# Altium schematic sheet Audio-HDMI.SchDoc
size A3; SheetNumber: 3; SheetTotal: 10
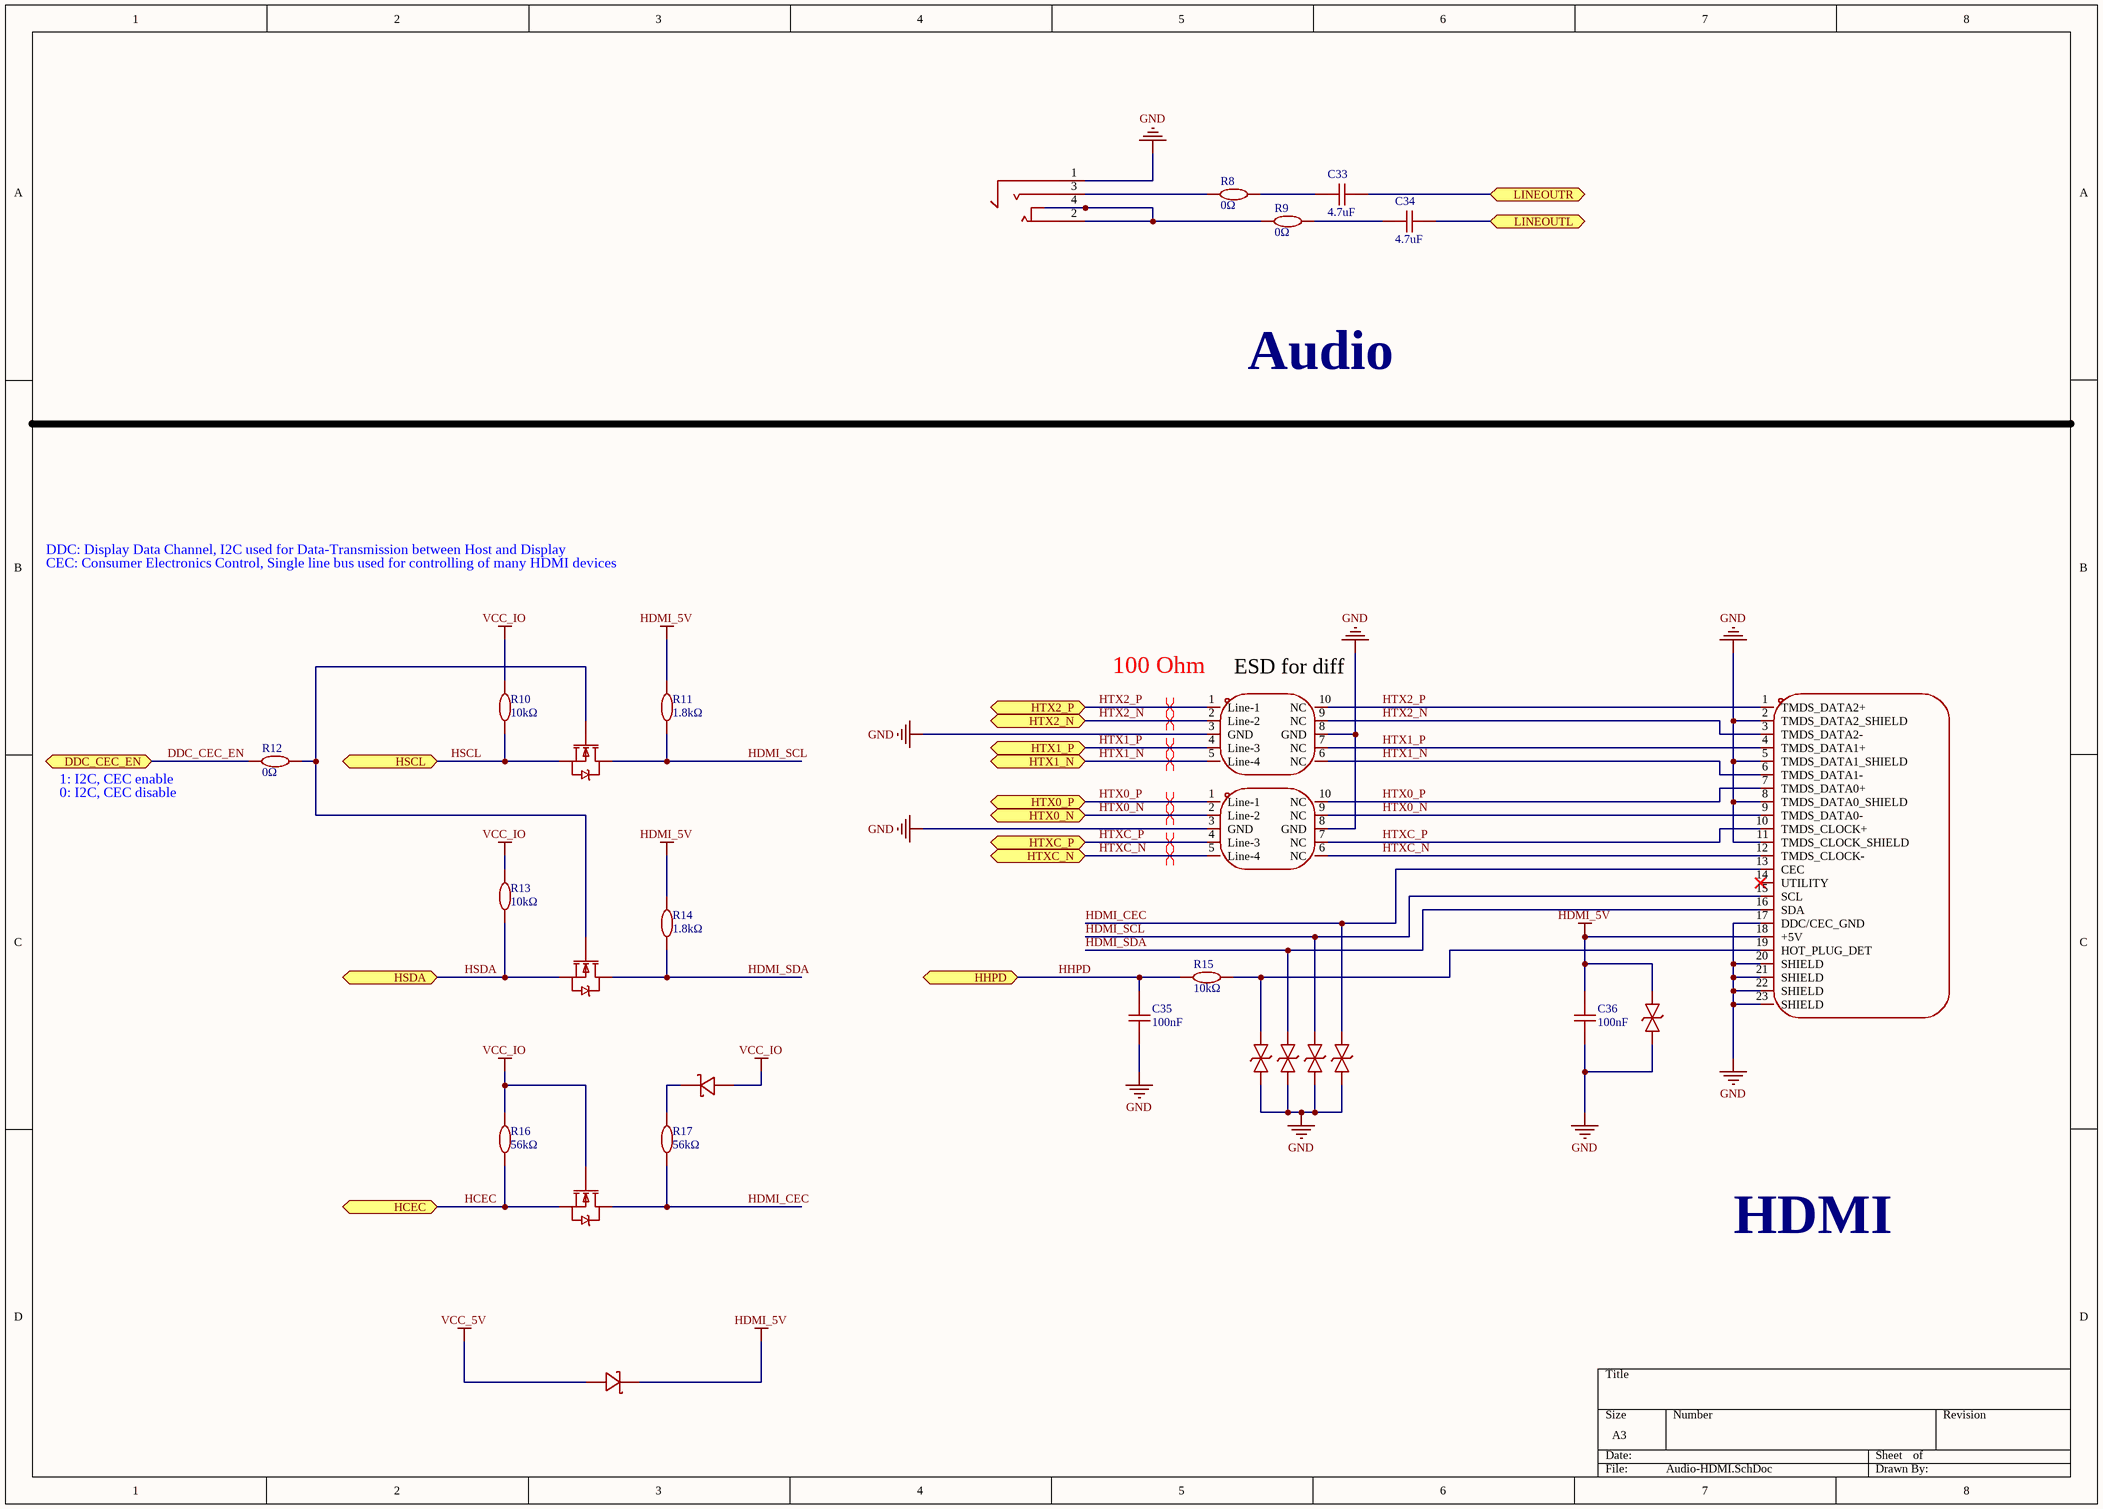
[diagram p0: Audio-HDMI.SchDoc]

## Parts
AUDIO1  PJ-327C-4A  [AUDIO-SMD_PJ-327C-4A]  (value not drawn)
C33  4.7uF  [C0402]
C34  4.7uF  [C0402]
C35  100nF  [C0402]
C36  100nF  [C0402]
CN1  KH-HDMI-19P-Cu  [HDMI-SMD_KH-HDMI-19P-CU]  (value not drawn)
D1  AZ1045-04F.R7G  [DFN2510-10_L2.5-W1.0-P0.50-BL]  (value not drawn)
D2  AZ1045-04F.R7G  [DFN2510-10_L2.5-W1.0-P0.50-BL]  (value not drawn)
D3  1N5819WS  [SOD-323_L1.8-W1.3-LS2.5-RD]  (value not drawn)
D4  1N5819WS  [SOD-323_L1.8-W1.3-LS2.5-RD]  (value not drawn)
Q1  BSN20  [SOT-23-3_L2.9-W1.6-P1.90-LS2.8-BR]  (value not drawn)
Q2  BSN20  [SOT-23-3_L2.9-W1.6-P1.90-LS2.8-BR]  (value not drawn)
Q3  BSN20  [SOT-23-3_L2.9-W1.6-P1.90-LS2.8-BR]  (value not drawn)
R8  0Ω  [R0402]
R9  0Ω  [R0402]
R10  10kΩ  [R0402]
R11  1.8kΩ  [R0402]
R12  0Ω  [R0402]
R13  10kΩ  [R0402]
R14  1.8kΩ  [R0402]
R15  10kΩ  [R0402]
R16  56kΩ  [R0402]
R17  56kΩ  [R0402]
U7  ESD5451N  [DFN1006-2L-BI]  (value not drawn)
U8  ESD5451N  [DFN1006-2L-BI]  (value not drawn)
U9  ESD5451N  [DFN1006-2L-BI]  (value not drawn)
U10  ESD5451N  [DFN1006-2L-BI]  (value not drawn)
U11  ESD5451N  [DFN1006-2L-BI]  (value not drawn)

## Ports
DDC_CEC_EN (bidir, see SoC_1[6B]), HCEC (bidir, see SoC_1[6C]), HHPD (bidir, see SoC_2[2B]), HSCL (bidir, see SoC_1[6B]), HSDA (bidir, see SoC_1[6B]), HTX0_N (bidir, see SoC_2[2B]), HTX0_P (bidir, see SoC_2[2B]), HTX1_N (bidir, see SoC_2[2B]), HTX1_P (bidir, see SoC_2[2B]), HTX2_N (bidir, see SoC_2[2B]), HTX2_P (bidir, see SoC_2[2B]), HTXC_N (bidir, see SoC_2[2B]), HTXC_P (bidir, see SoC_2[2B]), LINEOUTL (bidir, see SoC_2[4B]), LINEOUTR (bidir, see SoC_2[4B])

## Nets
GND: AUDIO1.1 C35.1 C36.1 CN1.2(TMDS_DATA2_SHIELD) CN1.5(TMDS_DATA1_SHIELD) CN1.8(TMDS_DATA0_SHIELD) CN1.11(TMDS_CLOCK_SHIELD) CN1.17(DDC/CEC_GND) CN1.20(SHIELD) CN1.21(SHIELD) CN1.22(SHIELD) CN1.23(SHIELD) D1.3(GND) D1.8(GND) D2.3(GND) D2.8(GND) U7.1 U8.1 U9.1 U10.1 U11.1
HDMI_5V: C36.2 CN1.18(+5V) D4.1(K) R11.2 R14.2 U7.2
VCC_5V: D4.2(A)
VCC_IO: D3.2(A) Q3.1(G) R10.2 R13.2 R16.2
DDC_CEC_EN: R12.1 ; port DDC_CEC_EN
HCEC: Q3.2(S) R16.1 ; port HCEC
HDMI_CEC: CN1.13(CEC) Q3.3(D) R17.1 U11.2
HDMI_SCL: CN1.15(SCL) Q1.3(D) R11.1 U10.2
HDMI_SDA: CN1.16(SDA) Q2.3(D) R14.1 U9.2
HHPD: C35.2 R15.1 ; port HHPD
HSCL: Q1.2(S) R10.1 ; port HSCL
HSDA: Q2.2(S) R13.1 ; port HSDA
HTX0_N: CN1.9(TMDS_DATA0-) D2.2(Line-2) D2.9(NC) ; port HTX0_N
HTX0_P: CN1.7(TMDS_DATA0+) D2.1(Line-1) D2.10(NC) ; port HTX0_P
HTX1_N: CN1.6(TMDS_DATA1-) D1.5(Line-4) D1.6(NC) ; port HTX1_N
HTX1_P: CN1.4(TMDS_DATA1+) D1.4(Line-3) D1.7(NC) ; port HTX1_P
HTX2_N: CN1.3(TMDS_DATA2-) D1.2(Line-2) D1.9(NC) ; port HTX2_N
HTX2_P: CN1.1(TMDS_DATA2+) D1.1(Line-1) D1.10(NC) ; port HTX2_P
HTXC_N: CN1.12(TMDS_CLOCK-) D2.5(Line-4) D2.6(NC) ; port HTXC_N
HTXC_P: CN1.10(TMDS_CLOCK+) D2.4(Line-3) D2.7(NC) ; port HTXC_P
LINEOUTL: C34.2 ; port LINEOUTL
LINEOUTR: C33.2 ; port LINEOUTR
NetAUDIO1_2: AUDIO1.2 AUDIO1.4 R9.1
NetAUDIO1_3: AUDIO1.3 R8.1
NetC33_1: C33.1 R8.2
NetC34_1: C34.1 R9.2
NetCN1_19: CN1.19(HOT_PLUG_DET) R15.2 U8.2
NetD3_1: D3.1(K) R17.2
NetQ1_1: Q1.1(G) Q2.1(G) R12.2

Not connected (* = marked no-connect by the designer): CN1 14(UTILITY)*

## Layout directives
differential pair: HTX0_N, HTX0_P, HTX1_N, HTX1_P, HTX2_N, HTX2_P, HTXC_N, HTXC_P

## Notes on the sheet
- Audio
- DDC: Display Data Channel, I2C used for Data-Transmission between Host and Display
- CEC: Consumer Electronics Control, Single line bus used for controlling of many HDMI devices
- (near D1) 100 Ohm
- (near D1) ESD for diff
- 1: I2C, CEC enable
- 0: I2C, CEC disable
- HDMI

## Library data of the parts
AUDIO1 = PJ-327C-4A: 3.5mm Headphone Jack 30V 500mA SMD Audio Connectors ROHS; Manufacturer: 韩国韩荣; Add into BOM: yes; Symbol: PJ-327C-4A; Device: PJ-327C-4A; LCSC Part Name: 3.5mm耳机座; Supplier Part: C145813; Manufacturer Part: PJ-327C-4A; Supplier Footprint: SMD; JLCPCB Part Class: Extended Part; Datasheet: https://item.szlcsc.com/datasheet/PJ-327C-4A/157145.html; Supplier: LCSC; Convert to PCB: yes; Connector Type: 3.5mm Headphone Jack; Current Rating: 500mA; Voltage Rating (Max): 30V
C33 C34 = 4.7uF: 10V 4.7uF X5R ±20% 0402 Ceramic Capacitors ROHS
C35 C36 = 100nF: 50V 100nF X7R ±10% 0402 Ceramic Capacitors ROHS
CN1 = KH-HDMI-19P-Cu: HDMI-A SMD USB, DVI, HDMI Connector Assemblies ROHS; Manufacturer: kinghelm(金航标); Add into BOM: yes; Gender: Mother; Symbol: KH-HDMI-19P-CU; Device: KH-HDMI-19P-Cu; LCSC Part Name: KH-HDMI-19P-Cu; Supplier Part: C709361; Manufacturer Part: KH-HDMI-19P-Cu; Supplier Footprint: SMD; JLCPCB Part Class: Extended Part; Datasheet: https://atta.szlcsc.com/upload/public/pdf/source/20211208/D47DE7411E98B8CA58BDDFA754B04DEC.pdf; Supplier: LCSC; Convert to PCB: yes; Connector Type: HDMI-A; Number of Pins: 19P; Mounting Style: Horizontal attachment; Current Rating (Max): -; Rated Voltage (Max): -; Operating Temperature Range: -
D1 D2 = AZ1045-04F.R7G: 3.5A@8/20us 30W@8/20us 12V 6V 5V DFN2510-10 TVS Diodes ROHS; Manufacturer: AMAZING(晶焱); Add into BOM: yes; Reverse Leakage Current (Ir): 1.5uA; Number of Channels: 4; level of protection: IEC 61000-4-5；IEC 61000-4-2; Type: ESD; Junction Capacitance: 0.5pF; Symbol: AZ1045-04F.R7G; Device: AZ1045-04F.R7G; LCSC Part Name: ESD 5V截止 峰值脉冲电流：3.5A@8/20us; Supplier Part: C356811; Manufacturer Part: AZ1045-04F.R7G; Supplier Footprint: DFN2510-10; JLCPCB Part Class: Extended Part; Datasheet: https://item.szlcsc.com/datasheet/AZ1045-04F.R7G/331915.html; Supplier: LCSC; Convert to PCB: yes; Reverse Stand-Off Voltage (Vrwm): 5V; Clamping Voltage: 12V; Peak Pulse Current (Ipp): 3.5A@8/20us; Peak Pulse Power Dissipation (Ppp): 30W@8/20us; Voltage - Breakdown: 6V
D3 D4 = 1N5819WS_C191023: 25A 40V 600mV@1A 1A SOD-323 Single Diodes ROHS; Manufacturer: Hottech(合科泰); Add into BOM: yes; Symbol: 1N5819WS; Device: 1N5819WS_C191023; LCSC Part Name: 电压:40V 电流:1A; Supplier Part: C191023; Manufacturer Part: 1N5819WS; Supplier Footprint: SOD-323; JLCPCB Part Class: Basic Part; Datasheet: https://item.szlcsc.com/datasheet/1N5819WS/213850.html; Supplier: LCSC; Convert to PCB: yes; Voltage - Forward(Vf@If): 600mV@1A; Voltage - DC Reverse(Vr): 40V; Current - Rectified: 1A; Non-Repetitive Peak Forward Surge Current: 25A
Q1-Q3 = BSN20_C116157: 50V 100mA 10Ω@2.75V,0.2A 1.5V@250uA 1 N-Channel SOT-23 Single FETs, MOSFETs ROHS; Manufacturer: SHIKUES(时科); Add into BOM: yes; Number: 1个N沟道; Input Capacitance(Ciss): 40pF; Reverse Transfer Capacitance (Crss@Vds): 10pF; Type: N沟道; Output Capacitance(Coss): 15pF; Symbol: BSN20; Device: BSN20_C116157; LCSC Part Name: 1个N沟道 耐压:50V 电流:0.1A; Supplier Part: C116157; Manufacturer Part: BSN20; Supplier Footprint: SOT-23; JLCPCB Part Class: Extended Part; Datasheet: https://item.szlcsc.com/datasheet/BSN20/117410.html; Supplier: LCSC; Convert to PCB: yes; Drain to Source Voltage: 50V; Current - Continuous Drain(Id): 100mA; RDS(on): 10Ω@2.75V,0.2A; Pd - Power Dissipation: -; Gate Threshold Voltage (Vgs(th)): 1.5V@250uA
R8 R9 R12 = 0Ω: 0Ω 62.5mW 50V Thick Film Resistor ±1% 0402 Chip Resistor - Surface Mount ROHS
R10 R13 R15 = 10kΩ: 62.5mW 10kΩ 50V ±100ppm/℃ Thick Film Resistor ±1% 0402 Chip Resistor - Surface Mount ROHS
R11 R14 = 1.8kΩ: 62.5mW 1.8kΩ 50V ±100ppm/℃ Thick Film Resistor ±1% 0402 Chip Resistor - Surface Mount ROHS
R16 R17 = 56kΩ: 56kΩ 62.5mW 50V ±100ppm/℃ Thick Film Resistor ±1% 0402 Chip Resistor - Surface Mount ROHS
U7-U11 = ESD5451N_C5261080: 9A 9.8V 8V Bidirectional 5V DFN1006-2L TVS Diodes ROHS; Manufacturer: HXY MOSFET(华轩阳电子); Add into BOM: yes; Reverse Leakage Current (Ir): 500nA; Number of Channels: 1.0; level of protection: IEC 61000-4-2; Junction Capacitance: 15pF; Symbol: ESD5451N_C5261080; Device: ESD5451N_C5261080; LCSC Part Name: 5V 15pF 双向; Supplier Part: C5261080; Manufacturer Part: ESD5451N; Supplier Footprint: DFN1006-2L; JLCPCB Part Class: Extended Part; Datasheet: https://item.szlcsc.com/datasheet/ESD5451N/5983779.html; Supplier: LCSC; Convert to PCB: yes; Polarity: Bidirectional; Reverse Stand-Off Voltage (Vrwm): 5V; Clamping Voltage: 9.8V; Peak Pulse Current (Ipp): 9A; Voltage - Breakdown: 8V; Type: ESD